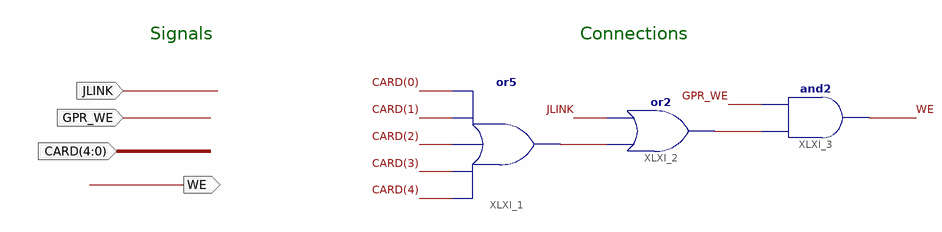
[diagram p0: schematic sheet 1]
// Xilinx ISE schematic FULL_DLX_GPR_opt2.sch (spartan6) as structural Verilog: 3 symbols, 4 ports
module FULL_DLX_GPR_opt2 (
  input  JLINK,
  input  GPR_WE,
  input  [4:0] CARD,
  output WE
);

  wire XLXN_1, XLXN_4;

  or XLXI_1 (XLXN_1, CARD[4], CARD[3], CARD[2], CARD[1], CARD[0]);
  or XLXI_2 (XLXN_4, XLXN_1, JLINK);
  and XLXI_3 (WE, XLXN_4, GPR_WE);

  // Notes on the sheet:
  //   Signals
  //   Connections
endmodule
